# EAGLE design RH048.2 (EAGLE 7.7.0)
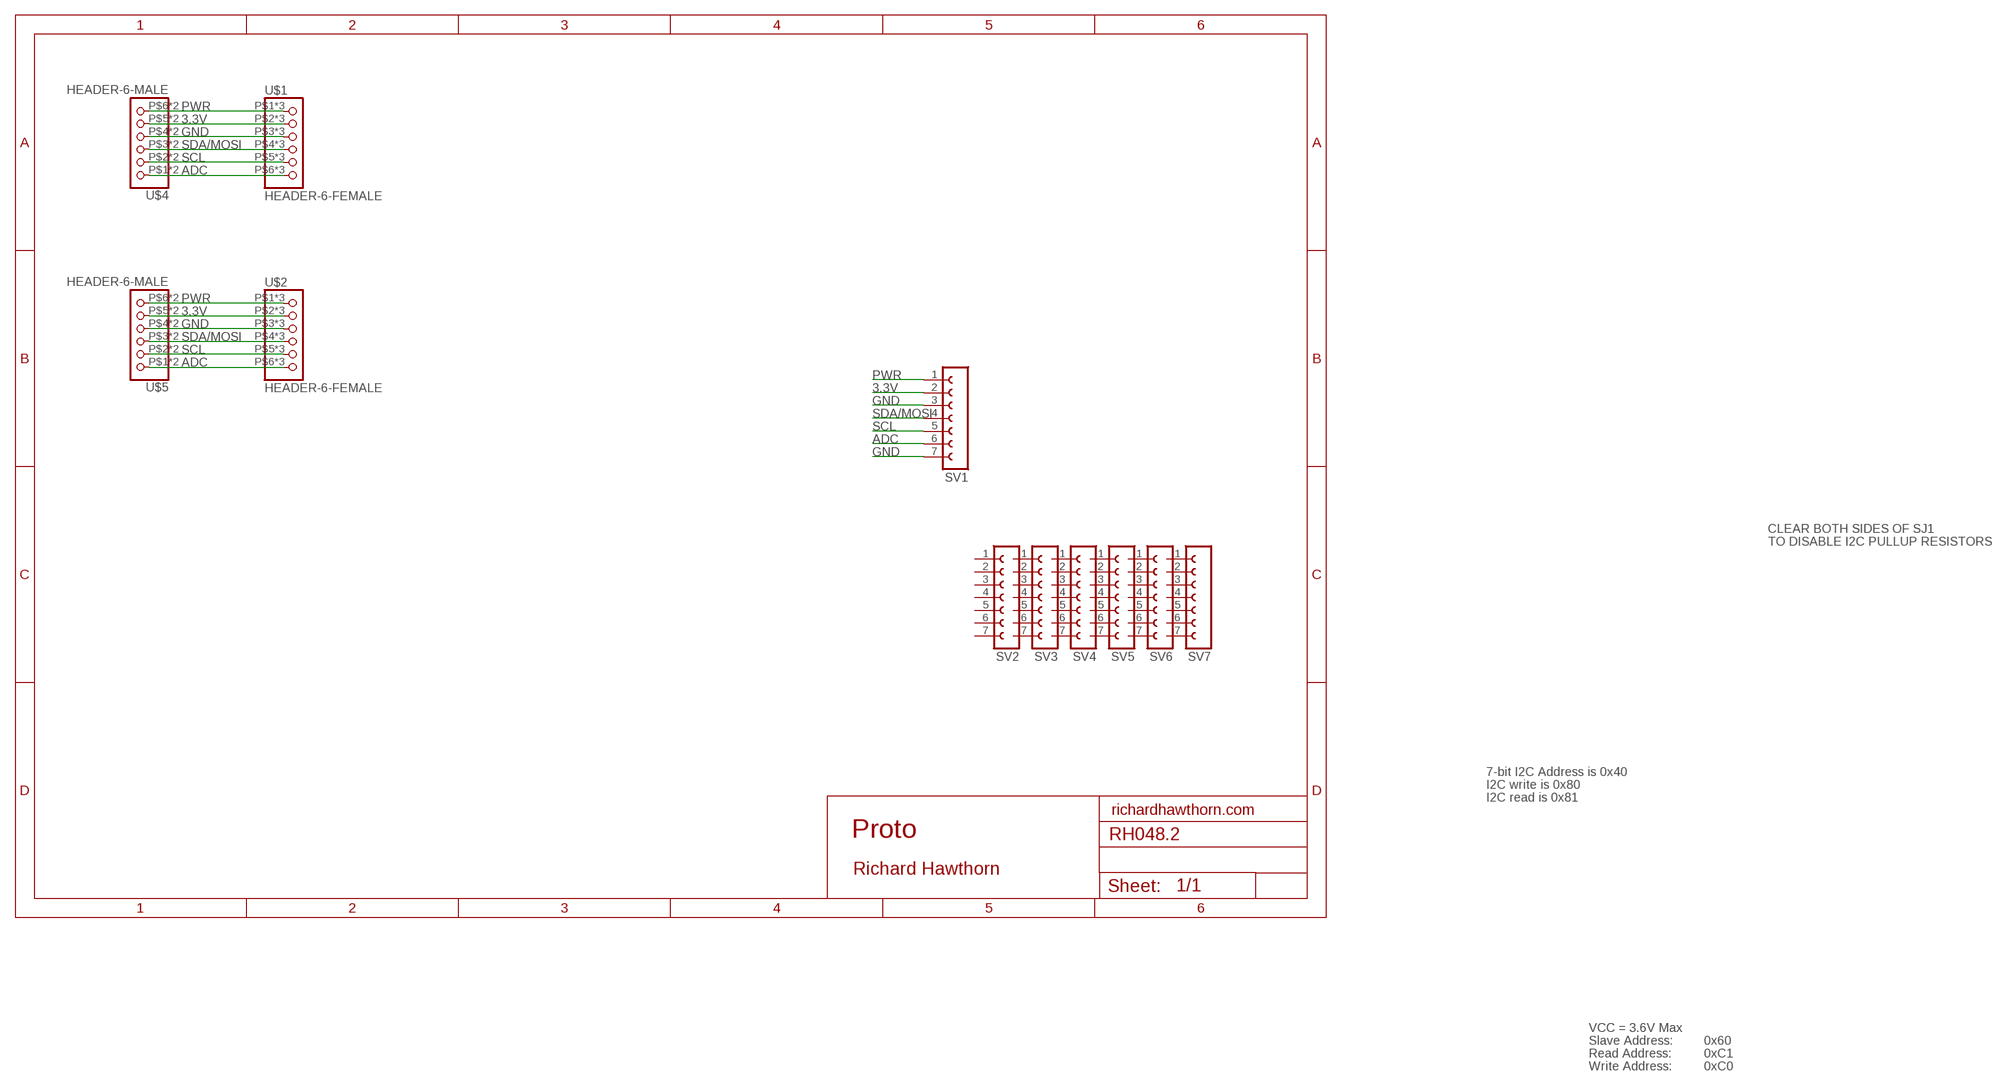
[diagram p0: schematic, sheet 1]

## Parts
SV1  FE07-1  [FE07]
SV2  FE07-1  [FE07]
SV3  FE07-1  [FE07]
SV4  FE07-1  [FE07]
SV5  FE07-1  [FE07]
SV6  FE07-1  [FE07]
SV7  FE07-1  [FE07]
U$1  HEADER-6-FEMALE  [2MMHEADER6]
U$2  HEADER-6-FEMALE  [2MMHEADER6]
U$4  HEADER-6-MALE  [2MMHEADERPIN6]
U$5  HEADER-6-MALE  [2MMHEADERPIN6]

## Nets
3.3V: SV1.2 U$1.P$2 U$1.P$10 U$1.P$18 U$2.P$2 U$2.P$10 U$2.P$18 U$4.P$5 U$4.P$13 U$5.P$5 U$5.P$13
ADC: SV1.6 U$1.P$6 U$1.P$14 U$1.P$22 U$2.P$6 U$2.P$14 U$2.P$22 U$4.P$1 U$4.P$9 U$5.P$1 U$5.P$9
GND [power]: SV1.3 SV1.7 U$1.P$3 U$1.P$11 U$1.P$19 U$2.P$3 U$2.P$11 U$2.P$19 U$4.P$4 U$4.P$12 U$5.P$4 U$5.P$12
PWR [power]: SV1.1 U$1.P$1 U$1.P$9 U$1.P$17 U$2.P$1 U$2.P$9 U$2.P$17 U$4.P$6 U$4.P$14 U$5.P$6 U$5.P$14
SCL: SV1.5 U$1.P$5 U$1.P$13 U$1.P$21 U$2.P$5 U$2.P$13 U$2.P$21 U$4.P$2 U$4.P$10 U$5.P$2 U$5.P$10
SDA/MOSI: SV1.4 U$1.P$4 U$1.P$12 U$1.P$20 U$2.P$4 U$2.P$12 U$2.P$20 U$4.P$3 U$4.P$11 U$5.P$3 U$5.P$11
Unconnected: SV2.1 SV2.2 SV2.3 SV2.4 SV2.5 SV2.6 SV2.7 SV3.1 SV3.2 SV3.3 SV3.4 SV3.5 SV3.6 SV3.7 SV4.1 SV4.2 SV4.3 SV4.4 SV4.5 SV4.6 SV4.7 SV5.1 SV5.2 SV5.3 SV5.4 SV5.5 SV5.6 SV5.7 SV6.1 SV6.2 SV6.3 SV6.4 SV6.5 SV6.6 SV6.7 SV7.1 SV7.2 SV7.3 SV7.4 SV7.5 SV7.6 SV7.7

## Notes on the sheet
- CLEAR BOTH SIDES OF SJ1
- TO DISABLE I2C PULLUP RESISTORS
- 7-bit I2C Address is 0x40
- I2C write is 0x80
- I2C read is 0x81
- richardhawthorn.com
- Proto
- Richard Hawthorn
- VCC = 3.6V Max
- Slave Address: | 0x60
- Read Address: | 0xC1
- Write Address: | 0xC0

## Library data of the parts
SV1-SV7 = con-lsta:FE07-1: FEMALE HEADER; OC_FARNELL: unknown; OC_NEWARK: unknown
U$1 U$2 = Richards:HEADER-6-FEMALE
U$4 U$5 = Richards:HEADER-6-MALE

## Net classes
1 power: width 0.381 mm, clearance 0.254 mm

## Board
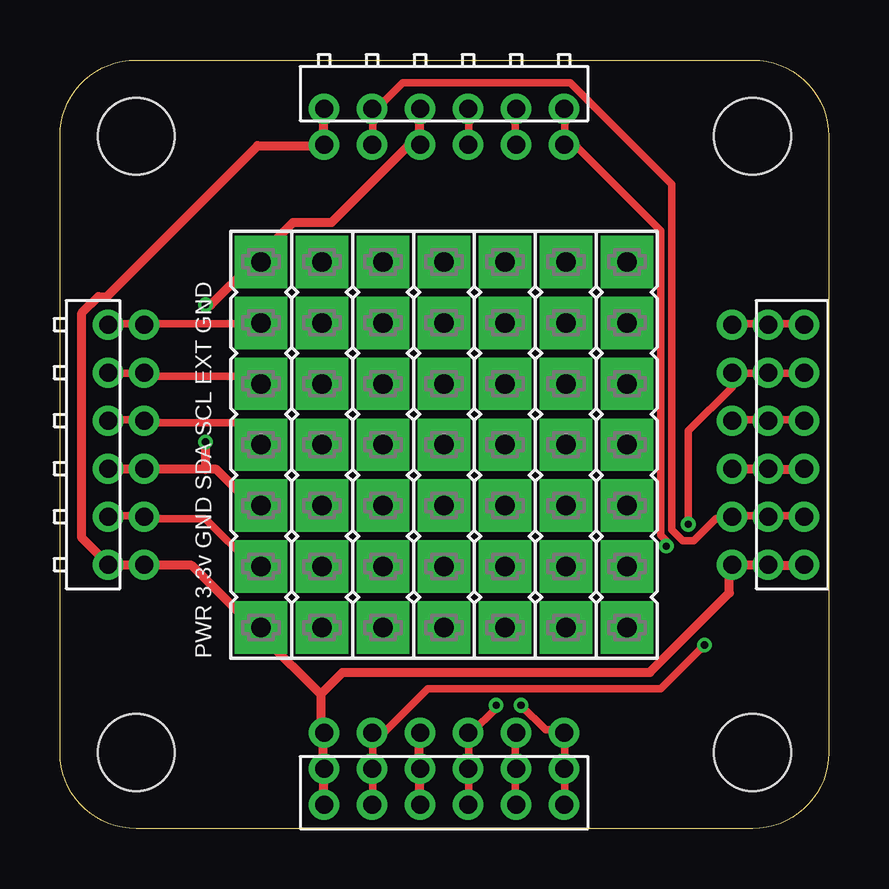
[diagram p1: board, top side]
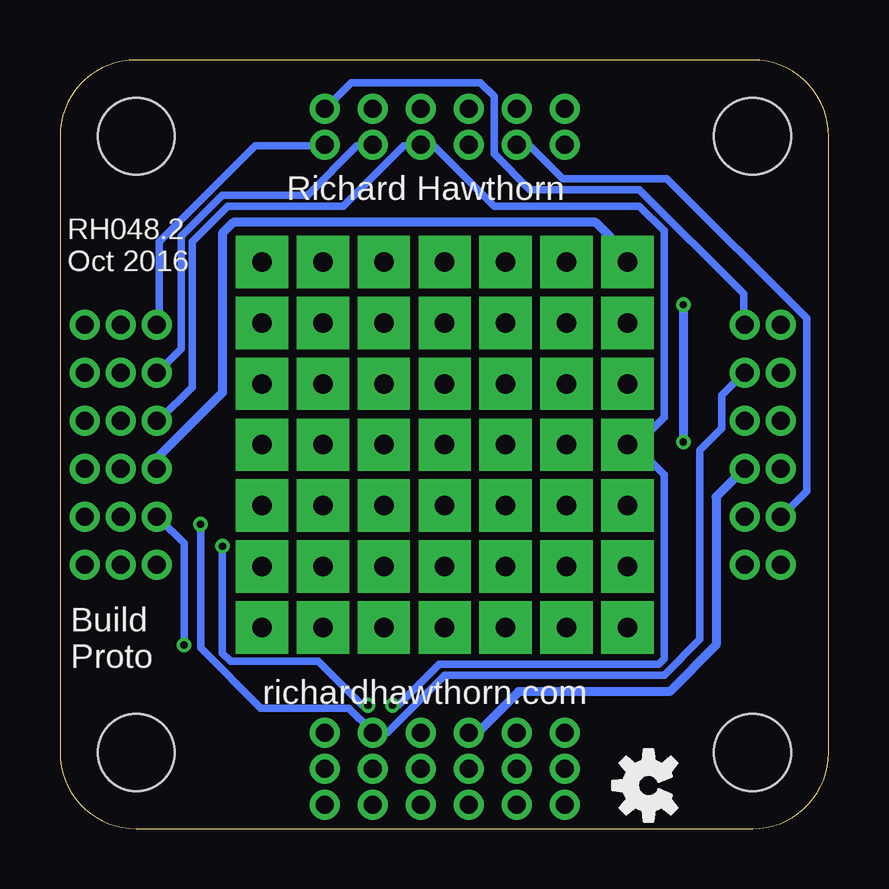
[diagram p2: board, bottom side, seen from below]

Size 32.03 x 32.03 mm. Coordinates in mm from the lower left corner, seen from the top.
Outline: 0,3.17 0,28.86 arc-90 3.17,32.03 28.86,32.03 arc-90 32.03,28.86 32.03,3.17 arc-90 28.86,0 3.17,0 arc-90 0,3.17
Copper layers (1*16): Top 0.035mm / dielectric 1.5mm / Bottom 0.035mm
Design rules "ITEADstudio_DRC *": minimum track width 12mil, minimum drill 12mil, track to track 6mil, track to pad 6mil, pad to pad 6mil, via to via 6mil, smd to smd 0mil, copper to edge 10mil, drill to drill 10mil, minimum pad ring 10mil, minimum via ring 6mil, stop-mask expansion 2mil, vias tented up to drill 100mil, thermal gap 15mil
Holes 3.2 mm at 3.17,3.17 28.86,3.17 3.17,28.86 28.86,28.86
tRestrict: area 0,0 to 5.7,5.7; area 26.3,0 to 32,5.7; area 26.3,26.3 to 32,32; area 0,26.3 to 5.7,32
bRestrict: area 0,26.3 to 5.7,32; area 26.3,26.3 to 32,32; area 26.3,0 to 32,5.7; area 0,0 to 5.7,5.7

### Footprints (pad centres in the part's own frame; a part is rotated, then mirrored left to right if it is on the bottom)
FE07 = drill 0.813 pad 2.184 square: 1 -7.62,0; 2 -5.08,0; 3 -2.54,0; 4 0,0; 5 2.54,0; 6 5.08,0; 7 7.62,0
2MMHEADER6 = drill 0.75: P$1 1,5; P$2 1,3; P$3 1,1; P$4 1,-1; P$5 1,-3; P$6 1,-5; P$9 -0.5,5; P$10 -0.5,3; P$11 -0.5,1; P$12 -0.5,-1; P$13 -0.5,-3; P$14 -0.5,-5; P$17 -2,5; P$18 -2,3; P$19 -2,1; P$20 -2,-1; P$21 -2,-3; P$22 -2,-5
2MMHEADERPIN6 = drill 0.75: P$1 1,5; P$2 1,3; P$3 1,1; P$4 1,-1; P$5 1,-3; P$6 1,-5; P$9 -0.5,5; P$10 -0.5,3; P$11 -0.5,1; P$12 -0.5,-1; P$13 -0.5,-3; P$14 -0.5,-5

### Placement (x,y rotation side)
SV1  8.38,16 90 top
SV2  23.62,16 90 top
SV3  21.08,16 90 top
SV4  18.54,16 90 top
SV5  16,16 90 top
SV6  10.92,16 90 top
SV7  13.46,16 90 top
U$1  16,3 90 top
U$2  29,16 180 top
U$3  [OSHW-LOGO-S]  7.5,1.8 90 bottom
U$4  16,29.5 270 top
U$5  2.5,16 0 top

### Tracks (layer width: path | path; a pad name or v marks a point on that pad's centre or on a via)
3.3V  (via drill 0.3)
  Top 0.305: U$1.P$18 13.03,1.03 13.03,2.4 U$1.P$10 13.03,2.63 13.03,3.89 U$1.P$2 13.14,4 13.49,4 15.32,5.83 25.03,5.83 v26.86,7.66 | U$2.P$18 30.98,13.03 29.6,13.03 U$2.P$10 29.49,13.03 28,13.03 U$2.P$2 27.89,12.92 27.32,12.92 26.4,12 25.95,12 25.49,12.46 25.49,26.86 21.26,31.09 14.29,31.09 13.14,29.95 U$4.P$13 13.03,29.95 13.03,28.57 U$4.P$5 | U$5.P$13 2.06,13.03 3.43,13.03 U$5.P$5 3.54,12.92 6.06,12.92 8,10.97 8.34,10.97 SV1.2
  Bottom 0.305: v26.86,7.66 26.86,11.89 27.89,12.92 U$2.P$2 | U$4.P$5 12.92,28.46 12.46,28.46 11.09,27.09 6.74,27.09 0.91,21.26 0.91,14.06 1.94,13.03 U$5.P$13
ADC  (via drill 0.3)
  Top 0.305: U$5.P$9 2.06,21.03 3.43,21.03 U$5.P$1 3.54,21.03 8.34,21.03 SV1.6 | U$1.P$22 21.03,1.03 21.03,2.4 U$1.P$14 21.03,2.63 21.03,3.89 U$1.P$6 20.92,4.12 20.23,4.12 v19.2,5.14 | U$4.P$9 21.03,29.95 21.03,28.57 U$4.P$1 21.14,28.46 21.49,28.46 25.03,24.92 25.03,12.23 25.26,12 v25.26,11.77 | U$2.P$6 28,21.03 29.49,21.03 U$2.P$14 29.6,21.03 30.98,21.03 U$2.P$22
  Bottom 0.305: U$4.P$1 21.03,28.46 23.89,28.46 27.89,24.46 27.89,21.03 U$2.P$6 | v19.2,5.14 19.43,5.14 21.26,6.97 24.92,6.97 25.26,7.32 v25.26,11.77 | U$5.P$1 3.54,21.03 3.54,22.29 7.89,26.63 12.46,26.63 13.95,28.12 13.95,30.52 14.52,31.09 19.89,31.09 20.92,30.06 U$4.P$9
GND  (via drill 0.3)
  Top 0.381: U$1.P$19 14.97,1.03 14.97,2.4 U$1.P$11 14.97,2.63 14.97,3.89 U$1.P$3 | U$5.P$12 2.06,14.97 3.43,14.97 U$5.P$4 3.66,14.97 6.06,14.97 | 6.06,14.97 6.51,14.97 8,13.49 8.34,13.49 SV1.3 | U$2.P$3 28,14.97 29.49,14.97 U$2.P$11 29.6,14.97 30.98,14.97 U$2.P$19 | U$4.P$12 14.97,29.95 14.97,28.57 U$4.P$4 14.86,28.46 14.52,28.46 11.32,25.26 9.72,25.26 8.46,24 8.46,23.66 SV1.7 8.23,23.55 8,23.55 6.29,21.83 v6.06,21.83 | v6.06,16.12 6.06,14.97
  Bottom 0.381: U$1.P$3 14.97,4 14.63,4 12.92,5.71 6.63,5.71 4.69,7.66 4.69,13.83 3.54,14.97 U$5.P$4 | U$2.P$3 27.89,15.09 27.89,15.54 25.26,18.17 25.26,24.8 24.8,25.26 9.72,25.26 8.46,24 8.46,23.66 SV1.7 | v6.06,21.83 v6.06,16.12
PWR
  Top 0.381: U$2.P$17 30.98,10.97 29.6,10.97 U$2.P$9 29.49,10.97 28,10.97 U$2.P$1 27.89,10.86 27.89,9.83 24.57,6.51 11.77,6.51 10.86,5.6 | U$1.P$17 10.97,1.03 10.97,2.4 U$1.P$9 10.97,2.63 10.97,3.89 U$1.P$1 10.86,4.12 10.86,5.6 | U$4.P$14 10.97,29.95 10.97,28.57 U$4.P$6 10.86,28.46 8.23,28.46 1.94,22.17 1.6,22.17 0.91,21.49 0.91,12.12 1.94,11.09 U$5.P$14 2.06,10.97 3.43,10.97 U$5.P$6 3.66,10.97 5.49,10.97 8,8.46 8.34,8.46 SV1.1 8.46,8.23 8.46,8 10.86,5.6
SCL  (via drill 0.3)
  Top 0.305: U$4.P$2 18.97,28.57 18.97,29.95 U$4.P$10 | U$2.P$21 30.98,18.97 29.6,18.97 U$2.P$13 29.49,18.97 28,18.97 U$2.P$5 28,18.86 28,18.4 26.18,16.57 v26.18,12.69 | U$1.P$21 18.97,1.03 18.97,2.4 U$1.P$13 18.97,2.63 18.97,3.89 U$1.P$5 | U$5.P$10 2.06,18.97 3.43,18.97 U$5.P$2 3.54,18.86 8.12,18.86 8.34,18.63 SV1.5
  Bottom 0.305: U$4.P$2 19.09,28.46 19.66,28.46 21.72,26.4 25.26,26.4 26.98,24.69 26.98,20 27.89,19.09 U$2.P$5 | U$5.P$2 3.54,18.97 4.46,18.06 4.46,16.69 5.37,15.77 5.37,7.89 6.86,6.4 16,6.4 18.4,4 18.97,4 U$1.P$5 19.09,4.12 20,5.03 23.66,5.03 26.18,7.54 v26.18,12.69
SDA/MOSI  (via drill 0.3)
  Top 0.305: U$4.P$3 17.03,28.57 17.03,29.95 U$4.P$11 | U$2.P$4 28,17.03 29.49,17.03 U$2.P$12 29.6,17.03 30.98,17.03 U$2.P$20 | U$1.P$20 17.03,1.03 17.03,2.4 U$1.P$12 17.03,2.63 17.03,3.89 U$1.P$4 17.14,4 18.17,5.03 v18.17,5.14 | U$5.P$11 2.06,17.03 3.43,17.03 U$5.P$3 3.54,16.92 7.43,16.92 8.34,16 SV1.4
  Bottom 0.305: U$2.P$4 27.89,17.03 26.52,18.4 26.52,24.46 25.03,25.95 20.23,25.95 17.72,28.46 17.03,28.46 U$4.P$3 16.92,28.46 16.46,28.46 13.95,25.95 7.89,25.95 6.86,24.92 6.86,17.14 8,16 SV1.4 8.34,15.89 8,15.89 6.86,14.74 6.86,7.09 7.09,6.86 16.23,6.86 17.95,5.14 v18.17,5.14

### Text on the board
tPlace: PWR 3.3v GND SDA SCL EXT GND
bPlace: Richard Hawthorn | RH048.2 / Oct 2016 | Build / Proto | richardhawthorn.com
tDocu: REG